# EAGLE design lipo-charge-reg-protect (EAGLE 7.2.0)
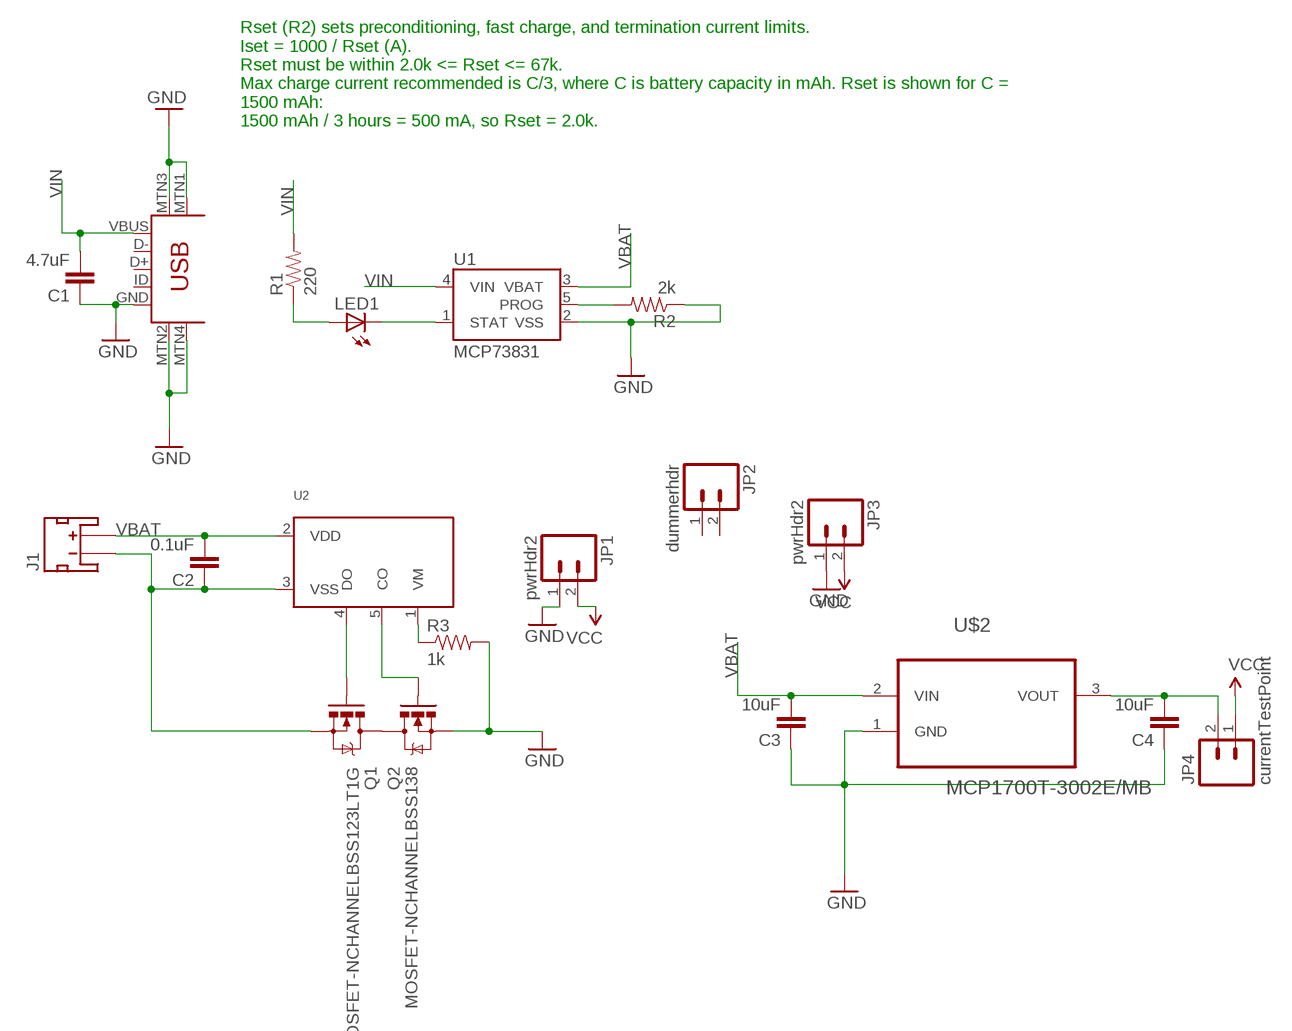
[diagram p0: schematic, sheet 1]

## Parts
C1  4.7uF  0.1UF-25V(+80/-20%)(0603)  [0603-CAP]
C2  0.1uF  0.1UF-25V(+80/-20%)(0603)  [0603-CAP]
C3  10uF  0.1UF-25V(+80/-20%)(0603)  [0603-CAP]
C4  10uF  0.1UF-25V(+80/-20%)(0603)  [0603-CAP]
J1  JST_2MM_MALE  [JST-2-SMD]
JP1  pwrHdr2  M02LOCK_LONGPADS  [1X02_LOCK_LONGPADS]
JP2  dummerhdr  M02LOCK_LONGPADS  [1X02_LOCK_LONGPADS]
JP3  pwrHdr2  M02LOCK_LONGPADS  [1X02_LOCK_LONGPADS]
JP4  currentTestPoint  M02LOCK_LONGPADS  [1X02_LOCK_LONGPADS]
LED1  LED0603  [LED-0603]
Q1  MOSFET-NCHANNELBSS123LT1G  [SOT23]
Q2  MOSFET-NCHANNELBSS138  [SOT23]
R1  220  0OHM1/10W5%(0603)  [0603]
R2  2k  0OHM1/10W5%(0603)  [0603]
R3  1k  0OHM1/10W5%(0603)  [0603]
U1  MCP73831  [SOT23-5]
U2  S-8241  [SOT23-5L]
U$1  USB-MINIB-5PIN  [USB-MINIB]
U$2  MCP1700T-3002E/MB  [SOT89]

## Nets
GND: C1.1 C3.1 C4.1 JP1.1 JP3.1 Q2.2(S) R2.1 R3.2 U1.2(VSS) U$1.GND U$1.MTN1(MTN2) U$1.MTN2(MTN3) U$1.MTN3(MTN1) U$1.MTN4 U$2.1(GND)
N$1: LED1.C U1.1(STAT)
N$2: LED1.A R1.1
N$3: R2.2 U1.5(PROG)
N$4: C2.1 J1.1(-) Q1.2(S) U2.3(VSS)
N$5: Q1.1(G) U2.4(DO)
N$6: Q1.3(D) Q2.3(D)
N$7: Q2.1(G) U2.5(CO)
N$8: R3.1 U2.1(VM)
N$9: C4.2 JP4.2 U$2.3(VOUT)
VBAT: C2.2 C3.2 J1.2(+) U1.3(VBAT) U2.2(VDD) U$2.2(VIN)
VCC: JP1.2 JP3.2 JP4.1
VIN: C1.2 R1.2 U1.4(VIN) U$1.VBUS
Unconnected: J1.NC1(PAD1) J1.NC2(PAD2) JP2.1 JP2.2 U$1.D+ U$1.D- U$1.ID

## Notes on the sheet
- Rset (R2) sets preconditioning, fast charge, and termination current limits.
  Iset = 1000 / Rset (A).
  Rset must be within 2.0k <= Rset <= 67k.
  Max charge current recommended is C/3, where C is battery capacity in mAh. Rset is shown for C =
  1500 mAh:
  1500 mAh / 3 hours = 500 mA, so Rset = 2.0k.

## Library data of the parts
C1 C3 C4 = SparkFun-Capacitors:0.1UF-25V(+80/-20%)(0603): CAP-00810 Ceramic Standard decoupling cap; PROD_ID: CAP-00810; VALUE: 0.1uF
C2 = SparkFun-Capacitors:0.1UF-25V(+80/-20%)(0603): CAP-00810 Ceramic Standard decoupling cap; PROD_ID: CAP-00810
J1 = SparkFun-Connectors:JST_2MM_MALE: Mates to single-cell LiPo batteries. CONN-08352; PROD_ID: CONN-08352
JP1-JP4 = SparkFun-Connectors:M02: Standard 2-pin 0.1" header. Use with - straight break away headers ( PRT-00116) - right angle break away headers (PRT-00553) - swiss pins (PRT-00743) - machine pins (PRT-00117) - female headers (PRT-00115) Molex polarized connector foot print use with: PRT-08233 with associated crimp pins and housings. 2.54_SCREWTERM for use with PRT-10571. 3.5mm Screw Terminal footprints for PRT-08084 5mm Screw Terminal footprints for use with PRT-08433
LED1 = SparkFun-LED:LED: LEDs Standard schematic elements and footprints for 5mm, 3mm, 1206, and 0603 sized LEDs. 5mm - Spark Fun Electronics SKU : COM-00529 (and others)
Q1 = electric_imp:MOSFET-NCHANNEL: Common NMOSFET Parts MFG P/N Store ID Prod ID FDD8780 TRANS-09984 SI7820DN TRANS-11055 FDS6630A IC-08089 2N7002PW TRANS-11151 FQP30N06L COM-10213 TRANS-10060 BSS123LT1G TRANS-08345 BSS138 TRANS-00830 BS170 2N7000; PROD_ID: TRANS-08345
Q2 = electric_imp:MOSFET-NCHANNEL: Common NMOSFET Parts MFG P/N Store ID Prod ID FDD8780 TRANS-09984 SI7820DN TRANS-11055 FDS6630A IC-08089 2N7002PW TRANS-11151 FQP30N06L COM-10213 TRANS-10060 BSS123LT1G TRANS-08345 BSS138 TRANS-00830 BS170 2N7000; PROD_ID: TRANS-00830
R1-R3 = SparkFun-Resistors:0OHM1/10W5%(0603): RES-08609; PROD_ID: RES-08609; VALUE: 0
U1 = electric_imp:MCP73831: Miniature single cell, fully integrated Li-Ion, Li-polymer charge management controller http://ww1.microchip.com/downloads/en/DeviceDoc/21984a.pdf IC-09995; PROD_ID: IC-09995
U2 = electric_imp:S-8241: Seiko S-8241
U$1 = SparkFun-Connectors:USB-MINIB: Mini-USB "B" connector with 5th pin broken out. Created new symbol breaking out 5th "ID" pin in mini/micro USB connector spec. See: http://en.wikipedia.org/wiki/Mini_usb#Cables. Uses same footprint as 4-pin symbol. Also added pins to connect to mounting / shield pads if required (probably not generally needed as signals aren't shielded once they leave the connector).
U$2 = electric_imp:MCP1700T-3002E/MB: 3.0V Low-Iq LDO - 250mA continuous current

## Board
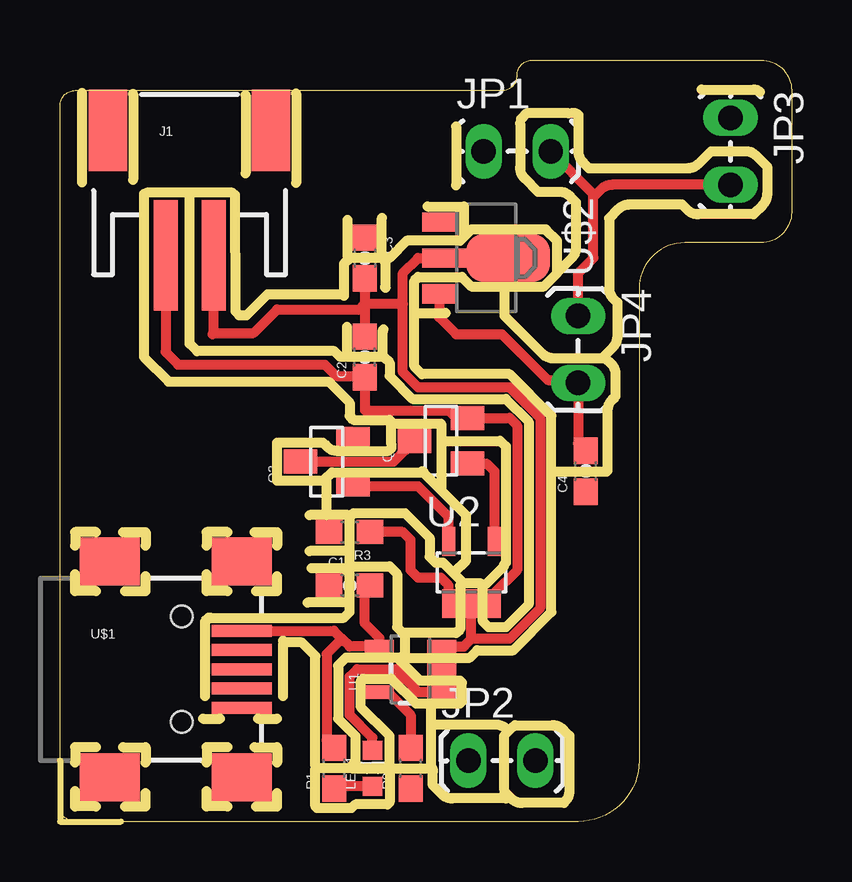
[diagram p1: board, top side]

Size 30.48 x 31.75 mm. Coordinates in mm from the lower left corner, seen from the top.
Outline: 24.13,22.23 24.13,2.54 arc-90 21.59,0 0.64,0 arc-90 0,0.64 0,29.84 arc-90 0.64,30.48 18.41,30.48 arc90 19.05,31.11 arc-90 19.68,31.75 29.21,31.75 arc-90 30.48,30.48 30.48,25.4 arc-90 29.21,24.13 26.04,24.13 arc90 24.13,22.23
Copper layers (1*16): Top 0.035mm / dielectric 1.5mm / Bottom 0.035mm
Design rules "Othermill-DRC-1-64": minimum track width 8mil, minimum drill 0.8mm, track to track 0.39878125mm, track to pad 0.39878125mm, pad to pad 0.39878125mm, via to via 0.39878125mm, smd to smd 0mil, copper to edge 0mil, drill to drill 1mil, minimum pad ring 10mil, minimum via ring 10mil, stop-mask expansion 1mil, vias tented up to drill 30mil, thermal gap 10mil
Milling: 274 lines

### Footprints (pad centres in the part's own frame; a part is rotated, then mirrored left to right if it is on the bottom)
0603-CAP = smd 1.1 x 1: 1 -0.85,0; 2 0.85,0
JST-2-SMD = smd 1 x 4.6: 1 -1,-3.7; 2 1,-3.7 | smd 1.6 x 3.4: NC1 -3.4,1.5; NC2 3.4,1.5
1X02_LOCK_LONGPADS = drill 1.016 long: 1 -0.127,0; 2 2.667,0
LED-0603 = smd 0.8 x 0.8: A 0,-0.75; C 0,0.75
SOT23 = smd 1 x 1.4: 1 -0.95,-1.1; 2 0.95,-1.1; 3 0,1.1
0603 = smd 1.1 x 1: 1 -0.85,0; 2 0.85,0
SOT23-5 = smd 0.55 x 1.2: 1 -0.95,-1.3; 2 0,-1.3; 3 0.95,-1.3; 4 0.95,1.3; 5 -0.95,1.3
SOT23-5L = smd 0.55 x 1.2: 1 -0.95,-1.3; 2 0,-1.3; 3 0.95,-1.3; 4 0.95,1.3; 5 -0.95,1.3
USB-MINIB = smd 2.5 x 0.5: D+ 2.5,0; D- 2.5,0.8; GND 2.5,-1.6; ID 2.5,-0.8; VBUS 2.5,1.6 | smd 2.5 x 2: MTN1 -3,4.5; MTN2 2.5,4.5; MTN3 -3,-4.5; MTN4 2.5,-4.5 | hole 0.9: 0,2.2; 0,-2.2
SOT89 = smd 0.8 x 1.4: 1 -1.499,-1.981; 3 1.499,-1.981 | smd 0.8 x 1.9: 2 0,-1.727 | smd 2 x 3.5: 2.1 0,0.889

### Placement (x,y rotation side)
C1  12.06,9.84 0 top
C2  12.7,19.37 90 top
C3  12.7,23.5 270 top
C4  21.91,14.61 90 top
J1  5.4,27.3 0 top
JP1  17.78,27.94 0 top
JP2  17.14,2.54 0 top
JP3  27.94,29.21 270 top
JP4  21.59,20.95 270 top
LED1  13.02,2.22 0 top
Q1  15.88,15.88 90 top
Q2  11.11,15 90 top
R1  11.43,2.22 90 top
R2  14.61,2.22 90 top
R3  12.06,12.06 180 top
U1  14.61,6.35 90 top
U2  17.14,10.38 0 top
U$1  5.08,6.35 0 top
U$2  17.78,23.5 270 top

### Tracks (layer width: path | path; a pad name or v marks a point on that pad's centre or on a via)
N$1
  Top 0.406: LED1.C 13.02,3.49 12.06,4.45 12.06,6.03 12.38,6.35 13.97,6.35 14.92,5.4 U1.1
N$2
  Top 0.406: LED1.A 11.53,1.47 R1.1
N$3
  Top 0.406: U1.5 13.65,5.4 14.61,4.45 R2.2
N$4
  Top 0.406: U2.3 18.09,9.52 19.05,10.48 19.05,16.51 18.73,16.82 Q1.2 16.51,16.82 16.19,17.14 12.7,17.14 C2.1 12.64,18.57 11.51,18.57 11.03,19.05 4.92,19.05 4.4,19.57 J1.1
N$5
  Top 0.406: Q1.1 17.78,14.93 18.1,14.61 U2.4
N$6
  Top 0.406: Q2.3 13.9,15 Q1.3
N$7
  Top 0.254: 12.75,13.97 12.29,13.97 Q2.1
  Top 0.406: U2.5 16.19,12.7 14.92,13.97 12.75,13.97
N$8
  Top 0.406: U2.1 16.2,9.84 15.88,10.16 14.92,10.16 14.61,10.48 14.61,11.75 14.29,12.06 R3.1
N$9
  Top 0.406: U$2.3 15.8,21.03 16.51,20.32 18.41,20.32 20.32,18.41 21.46,18.41 JP4.2 21.59,15.77 C4.2
VBAT
  Top 0.406: U1.3 16.82,7.3 17.14,7.62 | 17.14,7.62 U2.2 | 17.14,7.62 18.73,7.62 20,8.89 20,16.83 18.73,18.1 14.92,18.1 14.29,18.73 14.29,21.59 | 6.35,20.32 6.4,20.37 | 6.4,20.37 J1.2 | 14.29,21.59 14.29,22.86 14.92,23.5 U$2.2 | C3.2 12.7,21.59 | 12.7,21.59 14.29,21.59 | 12.7,21.59 C2.2 | 6.4,20.37 8.06,20.37 9.05,21.35 12.46,21.35 12.7,21.59
VCC
  Top 0.406: JP4.1 21.59,22.86 22.23,23.5 22.23,26.04 | 22.23,26.04 22.23,26.16 JP1.2 | JP3.2 23,26.54 arc45 22.55,26.36 22.23,26.04
VIN
  Top 0.406: C1.2 12.7,9.63 12.7,8.26 13.3,7.65 U1.4 12.06,7.3 11.74,7.62 | U$1.VBUS 11.41,7.95 11.74,7.62 | 11.74,7.62 11.11,6.99 11.11,3.39 R1.2